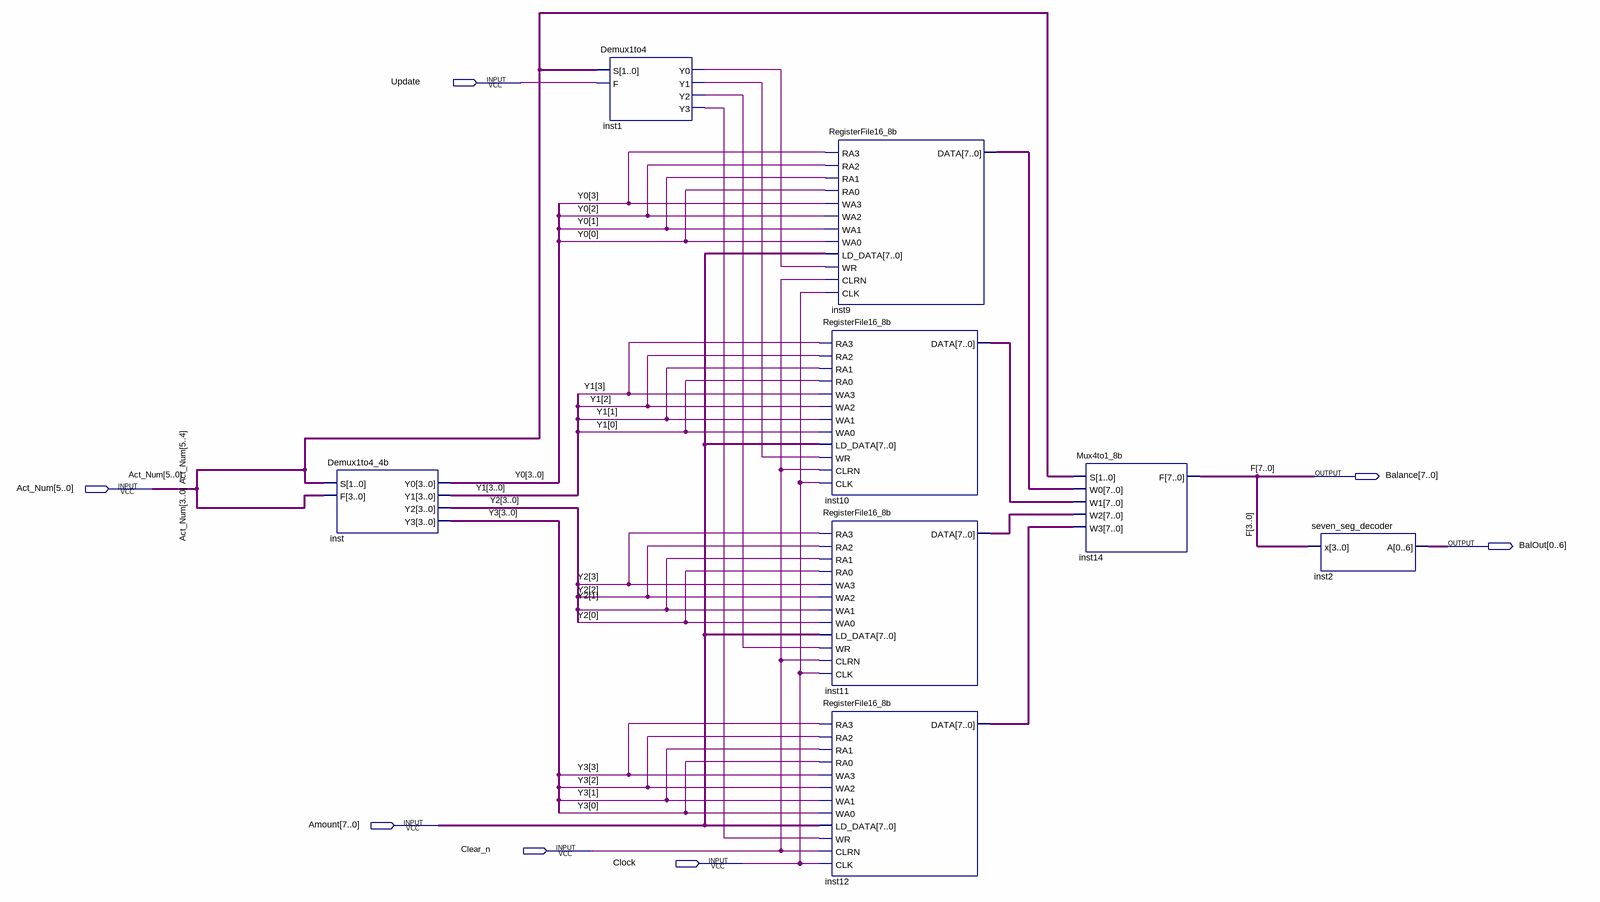
[diagram p0: schematic sheet]
// Quartus schematic AccountBalances.bdf as structural Verilog: 8 symbols, 7 pins
module AccountBalances (
  input  Update,
  input  [5:0] Act_Num,
  input  [7:0] Amount,
  input  Clear_n,
  input  Clock,
  output [7:0] Balance,
  output [0:6] BalOut
);

  wire inst1_y0, inst1_y1, inst1_y2, inst1_y3;
  wire [3:0] Y0, Y1, Y2, Y3;
  wire [7:0] inst9_data, inst10_data, inst11_data, inst12_data;

  Demux1to4_4b inst (.S(Act_Num[5:4]), .F(Act_Num[3:0]), .Y0(Y0), .Y1(Y1), .Y2(Y2), .Y3(Y3));
  Demux1to4 inst1 (.S(Act_Num[5:4]), .F(Update), .Y0(inst1_y0), .Y1(inst1_y1), .Y2(inst1_y2), .Y3(inst1_y3));
  RegisterFile16_8b inst9 (
    .RA3(Y0[3]), .RA2(Y0[2]), .RA1(Y0[1]), .RA0(Y0[0]), .WA3(Y0[3]), .WA2(Y0[2]), .WA1(Y0[1]), .WA0(Y0[0]),
    .LD_DATA(Amount), .WR(inst1_y0), .CLRN(Clear_n), .CLK(Clock), .DATA(inst9_data));
  RegisterFile16_8b inst10 (
    .RA3(Y1[3]), .RA2(Y1[2]), .RA1(Y1[1]), .RA0(Y1[0]), .WA3(Y1[3]), .WA2(Y1[2]), .WA1(Y1[1]), .WA0(Y1[0]),
    .LD_DATA(Amount), .WR(inst1_y1), .CLRN(Clear_n), .CLK(Clock), .DATA(inst10_data));
  RegisterFile16_8b inst11 (
    .RA3(Y2[3]), .RA2(Y2[2]), .RA1(Y2[1]), .RA0(Y2[0]), .WA3(Y2[3]), .WA2(Y2[2]), .WA1(Y2[1]), .WA0(Y2[0]),
    .LD_DATA(Amount), .WR(inst1_y2), .CLRN(Clear_n), .CLK(Clock), .DATA(inst11_data));
  RegisterFile16_8b inst12 (
    .RA3(Y3[3]), .RA2(Y3[2]), .RA1(Y3[1]), .RA0(Y3[0]), .WA3(Y3[3]), .WA2(Y3[2]), .WA1(Y3[1]), .WA0(Y3[0]),
    .LD_DATA(Amount), .WR(inst1_y3), .CLRN(Clear_n), .CLK(Clock), .DATA(inst12_data));
  Mux4to1_8b inst14 (
    .S(Act_Num[5:4]), .W0(inst9_data), .W1(inst10_data), .W2(inst11_data), .W3(inst12_data), .F(Balance));
  seven_seg_decoder inst2 (.x(Balance[3:0]), .A(BalOut));

  // Other names for the same wires on the sheet: F[7:0] = Balance
endmodule
